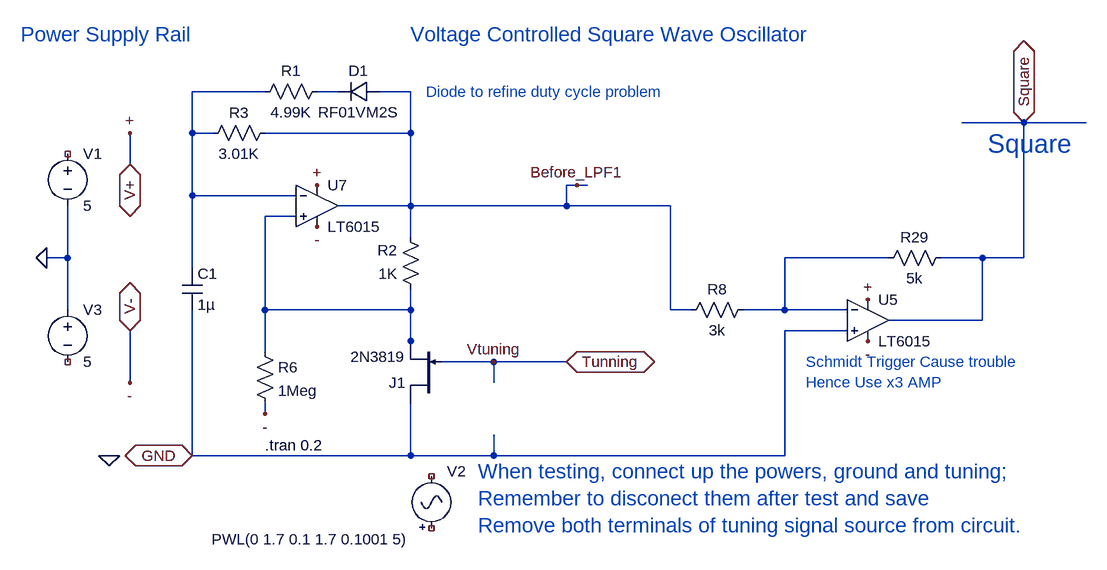
[diagram p0: schematic Square_VCO.asc]
Square_VCO.asc, the LTspice schematic file:
Version 4
SHEET 1 6980 1512
WIRE 96 144 -16 144
WIRE 208 144 176 144
WIRE 320 144 272 144
WIRE 1264 192 1168 192
WIRE 1360 192 1264 192
WIRE -16 208 -16 144
WIRE 16 208 -16 208
WIRE 320 208 320 144
WIRE 320 208 96 208
WIRE -112 256 -112 208
WIRE 576 288 560 288
WIRE 592 288 576 288
WIRE -16 304 -16 208
WIRE 144 304 -16 304
WIRE 320 320 320 208
WIRE 320 320 208 320
WIRE 560 320 560 288
WIRE 560 320 320 320
WIRE 720 320 560 320
WIRE 144 336 96 336
WIRE 320 368 320 320
WIRE -208 400 -208 320
WIRE -208 400 -240 400
WIRE 1056 400 896 400
WIRE 1200 400 1136 400
WIRE 1264 400 1264 192
WIRE 1264 400 1200 400
WIRE -16 416 -16 304
WIRE -208 480 -208 400
WIRE 96 480 96 336
WIRE 320 480 320 448
WIRE 320 480 96 480
WIRE 720 480 720 320
WIRE 752 480 720 480
WIRE 896 480 896 400
WIRE 896 480 832 480
WIRE 992 480 896 480
WIRE 1200 496 1200 400
WIRE 1200 496 1056 496
WIRE 992 512 896 512
WIRE 320 528 320 480
WIRE 96 544 96 480
WIRE 320 544 320 528
WIRE 448 560 368 560
WIRE 560 560 448 560
WIRE -112 592 -112 512
WIRE 448 592 448 560
WIRE 96 640 96 624
WIRE -16 704 -16 480
WIRE 320 704 320 624
WIRE 320 704 -16 704
WIRE 448 704 448 672
WIRE 448 704 320 704
WIRE 896 704 896 512
WIRE 896 704 448 704
FLAG -112 208 +
FLAG -112 592 -
FLAG 448 560 Vtuning
FLAG 1264 192 Square
IOPIN 1264 192 BiDir
FLAG 1024 464 +
FLAG 1024 528 -
FLAG 176 288 +
FLAG 176 352 -
FLAG 576 288 Before_LPF1
FLAG -16 704 GND
IOPIN -16 704 BiDir
FLAG -112 256 V+
IOPIN -112 256 BiDir
FLAG -112 512 V-
IOPIN -112 512 BiDir
FLAG -240 400 0
FLAG -144 704 0
FLAG 560 560 Tunning
IOPIN 560 560 BiDir
FLAG 96 640 -
SYMBOL res 336 464 R180
WINDOW 0 36 76 Left 2
WINDOW 3 36 40 Left 2
SYMATTR InstName R2
SYMATTR Value 1K
SYMATTR SpiceLine tol=1 pwr=0.1
SYMBOL res 112 192 R90
WINDOW 0 0 56 VBottom 2
WINDOW 3 32 56 VTop 2
SYMATTR InstName R3
SYMATTR Value 3.01K
SYMATTR SpiceLine tol=1 pwr=0.1
SYMBOL cap -32 416 R0
SYMATTR InstName C1
SYMATTR Value 1µ
SYMATTR SpiceLine V=4 Irms=0 Rser=0 Lser=0 mfg="Murata" pn="GRM155R70G105KA12" type="X7R"
SYMBOL voltage -208 224 R0
WINDOW 123 0 0 Left 0
WINDOW 39 0 0 Left 0
SYMATTR InstName V1
SYMATTR Value 5
SYMBOL res 80 528 R0
SYMATTR InstName R6
SYMATTR Value 1Meg
SYMATTR SpiceLine tol=1 pwr=0.1
SYMBOL njf 368 624 R180
SYMATTR InstName J1
SYMATTR Value 2N3819
SYMBOL Misc\\signal 352 832 M180
WINDOW 0 24 104 Left 2
WINDOW 3 -338 -1 Left 2
WINDOW 123 0 0 Left 0
WINDOW 39 0 0 Left 0
SYMATTR InstName V2
SYMATTR Value PWL(0 1.7 0.1 1.7 0.1001 5)
SYMBOL voltage -208 464 R0
WINDOW 123 0 0 Left 0
WINDOW 39 0 0 Left 0
SYMATTR InstName V3
SYMATTR Value 5
SYMBOL Opamps\\LT6015 1024 496 R0
SYMATTR InstName U5
SYMBOL Opamps\\LT6015 176 320 R0
SYMATTR InstName U7
SYMBOL res 848 464 R90
WINDOW 0 0 56 VBottom 2
WINDOW 3 32 56 VTop 2
SYMATTR InstName R8
SYMATTR Value 3k
SYMBOL res 1152 384 R90
WINDOW 0 0 56 VBottom 2
WINDOW 3 32 56 VTop 2
SYMATTR InstName R29
SYMATTR Value 5k
SYMBOL diode 272 160 M270
WINDOW 0 32 32 VTop 2
WINDOW 3 0 32 VBottom 2
SYMATTR InstName D1
SYMATTR Value RF01VM2S
SYMBOL res 192 128 R90
WINDOW 0 0 56 VBottom 2
WINDOW 3 32 56 VTop 2
SYMATTR InstName R1
SYMATTR Value 4.99K
SYMATTR SpiceLine tol=1 pwr=0.1
TEXT 96 688 Left 2 !.tran 0.2
TEXT -280 56 Left 3 ;Power Supply Rail
TEXT 320 56 Left 3 ;Voltage Controlled Square Wave Oscillator
TEXT 1208 224 Left 4 ;Square
TEXT 424 728 Left 3 ;When testing, connect up the powers, ground and tuning;\nRemember to disconect them after test and save\nRemove both terminals of tuning signal source from circuit.
TEXT 928 560 Left 2 ;Schmidt Trigger Cause trouble\nHence Use x3 AMP
TEXT 344 144 Left 2 ;Diode to refine duty cycle problem

The netlist it stands for:
* Square_VCO.asc
R2 N003 Before_LPF1 1K tol=1 pwr=0.1
R3 Before_LPF1 N001 3.01K tol=1 pwr=0.1
C1 N001 GND 1µ V=4 Irms=0 Rser=0 Lser=0 mfg="Murata" pn="GRM155R70G105KA12" type="X7R"
V1 NC_01 0 5
R6 N003 V- 1Meg tol=1 pwr=0.1
J1 GND Tunning N003 2N3819
V2 NC_02 NC_03 PWL(0 1.7 0.1 1.7 0.1001 5)
V3 0 NC_04 5
XU5 GND N004 V+ V- Square LT6016  ; LT6015, pins In+ In- V+ V- OUT
XU7 N003 N001 V+ V- Before_LPF1 LT6016  ; LT6015, pins In+ In- V+ V- OUT
R8 N004 Before_LPF1 3k
R29 Square N004 5k
D1 Before_LPF1 N002 RF01VM2S
R1 N002 N001 4.99K tol=1 pwr=0.1
.model D D
.lib standard.dio
.model NJF NJF
.model PJF PJF
.lib standard.jft
.tran 0.2
* Power Supply Rail
* Voltage Controlled Square Wave Oscillator
* Square
* When testing, connect up the powers, ground and tuning;
* Remember to disconect them after test and save
* Remove both terminals of tuning signal source from circuit.
* Schmidt Trigger Cause trouble
* Hence Use x3 AMP
* Diode to refine duty cycle problem
.lib LTC2.lib
.backanno
.end